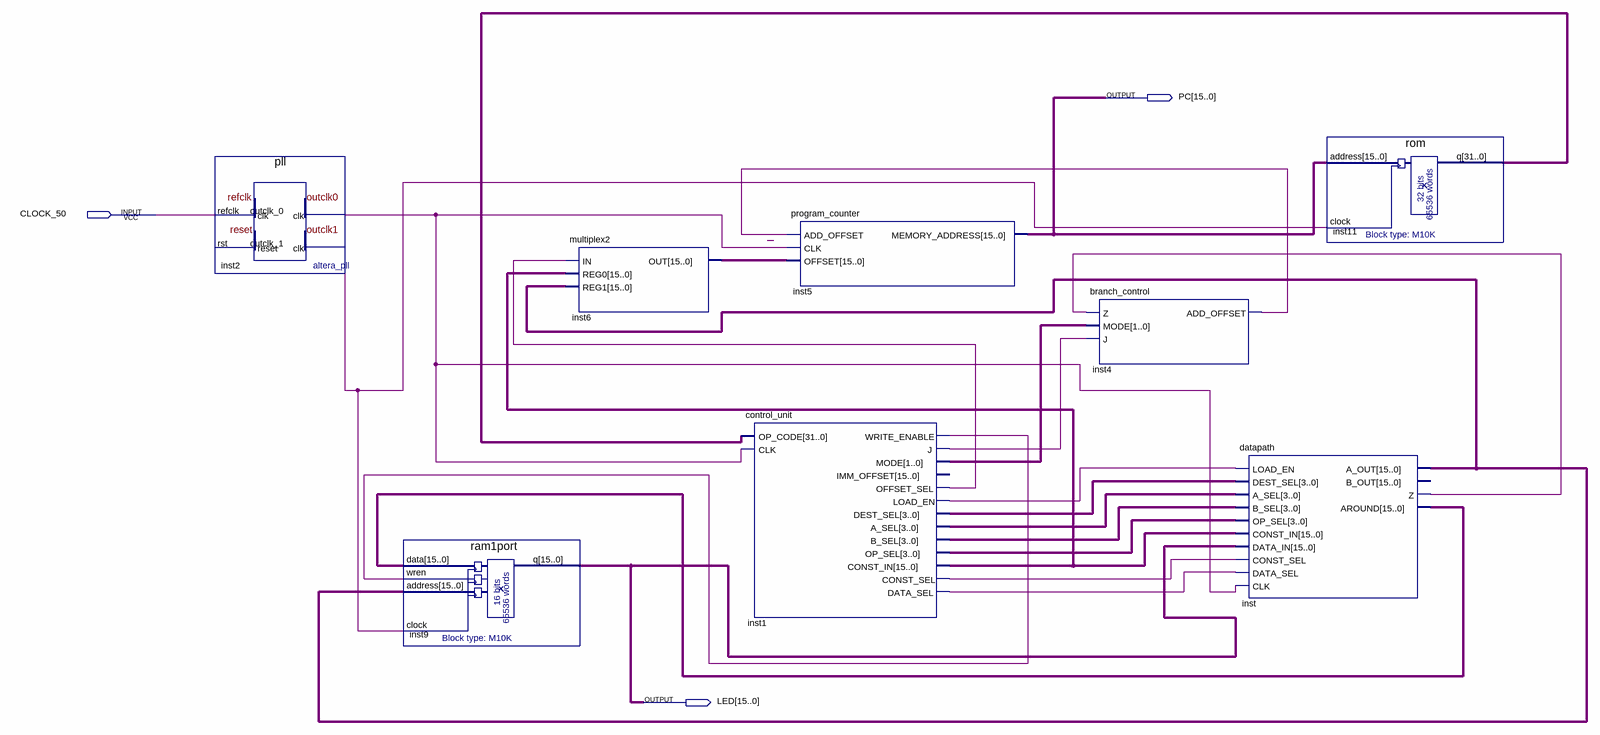
[diagram p0: schematic sheet]
// Quartus schematic project.bdf as structural Verilog: 8 symbols, 3 pins
module project (
  input  CLOCK_50,
  output [15:0] PC,
  output [15:0] LED
);

  wire inst1_const_sel, inst1_data_sel, inst1_j, inst1_load_en, inst1_offset_sel, inst1_write_enable,
       inst2_outclk_0, inst2_outclk_1, inst4_add_offset, inst_z;
  wire [1:0] inst1_mode;
  wire [3:0] inst1_a_sel, inst1_b_sel, inst1_dest_sel, inst1_op_sel;
  wire [15:0] inst1_const_in, inst6_out, inst_a_out, inst_around;
  wire [31:0] inst11_q;

  pll inst2 (.refclk(CLOCK_50), .outclk_0(inst2_outclk_0), .outclk_1(inst2_outclk_1));  // open: rst
  ram1port inst9 (.data(inst_around), .wren(inst1_write_enable), .address(inst_a_out), .clock(inst2_outclk_1), .q(LED));
  multiplex2 inst6 (.IN(inst1_offset_sel), .REG0(inst1_const_in), .REG1(inst_a_out), .OUT(inst6_out));
  program_counter inst5 (.ADD_OFFSET(inst4_add_offset), .CLK(inst2_outclk_0), .OFFSET(inst6_out), .MEMORY_ADDRESS(PC));
  control_unit inst1 (
    .OP_CODE(inst11_q), .CLK(inst2_outclk_0), .WRITE_ENABLE(inst1_write_enable), .J(inst1_j),
    .MODE(inst1_mode), .OFFSET_SEL(inst1_offset_sel), .LOAD_EN(inst1_load_en), .DEST_SEL(inst1_dest_sel),
    .A_SEL(inst1_a_sel), .B_SEL(inst1_b_sel), .OP_SEL(inst1_op_sel), .CONST_IN(inst1_const_in),
    .CONST_SEL(inst1_const_sel), .DATA_SEL(inst1_data_sel));  // open: IMM_OFFSET
  branch_control inst4 (.Z(inst_z), .MODE(inst1_mode), .J(inst1_j), .ADD_OFFSET(inst4_add_offset));
  datapath inst (
    .LOAD_EN(inst1_load_en), .DEST_SEL(inst1_dest_sel), .A_SEL(inst1_a_sel), .B_SEL(inst1_b_sel),
    .OP_SEL(inst1_op_sel), .CONST_IN(inst1_const_in), .DATA_IN(LED), .CONST_SEL(inst1_const_sel),
    .DATA_SEL(inst1_data_sel), .CLK(inst2_outclk_0), .A_OUT(inst_a_out), .Z(inst_z), .AROUND(inst_around));  // open: B_OUT
  rom inst11 (.address(PC), .clock(inst2_outclk_1), .q(inst11_q));
endmodule
